# Altium schematic sheet TOPLEVEL.SchDoc
size A2; Organization: Altium Limited; Address1: L3, 12a Rodborough Rd; Address2: Frenchs Forest; Address3: NSW; Address4: Australia 2086
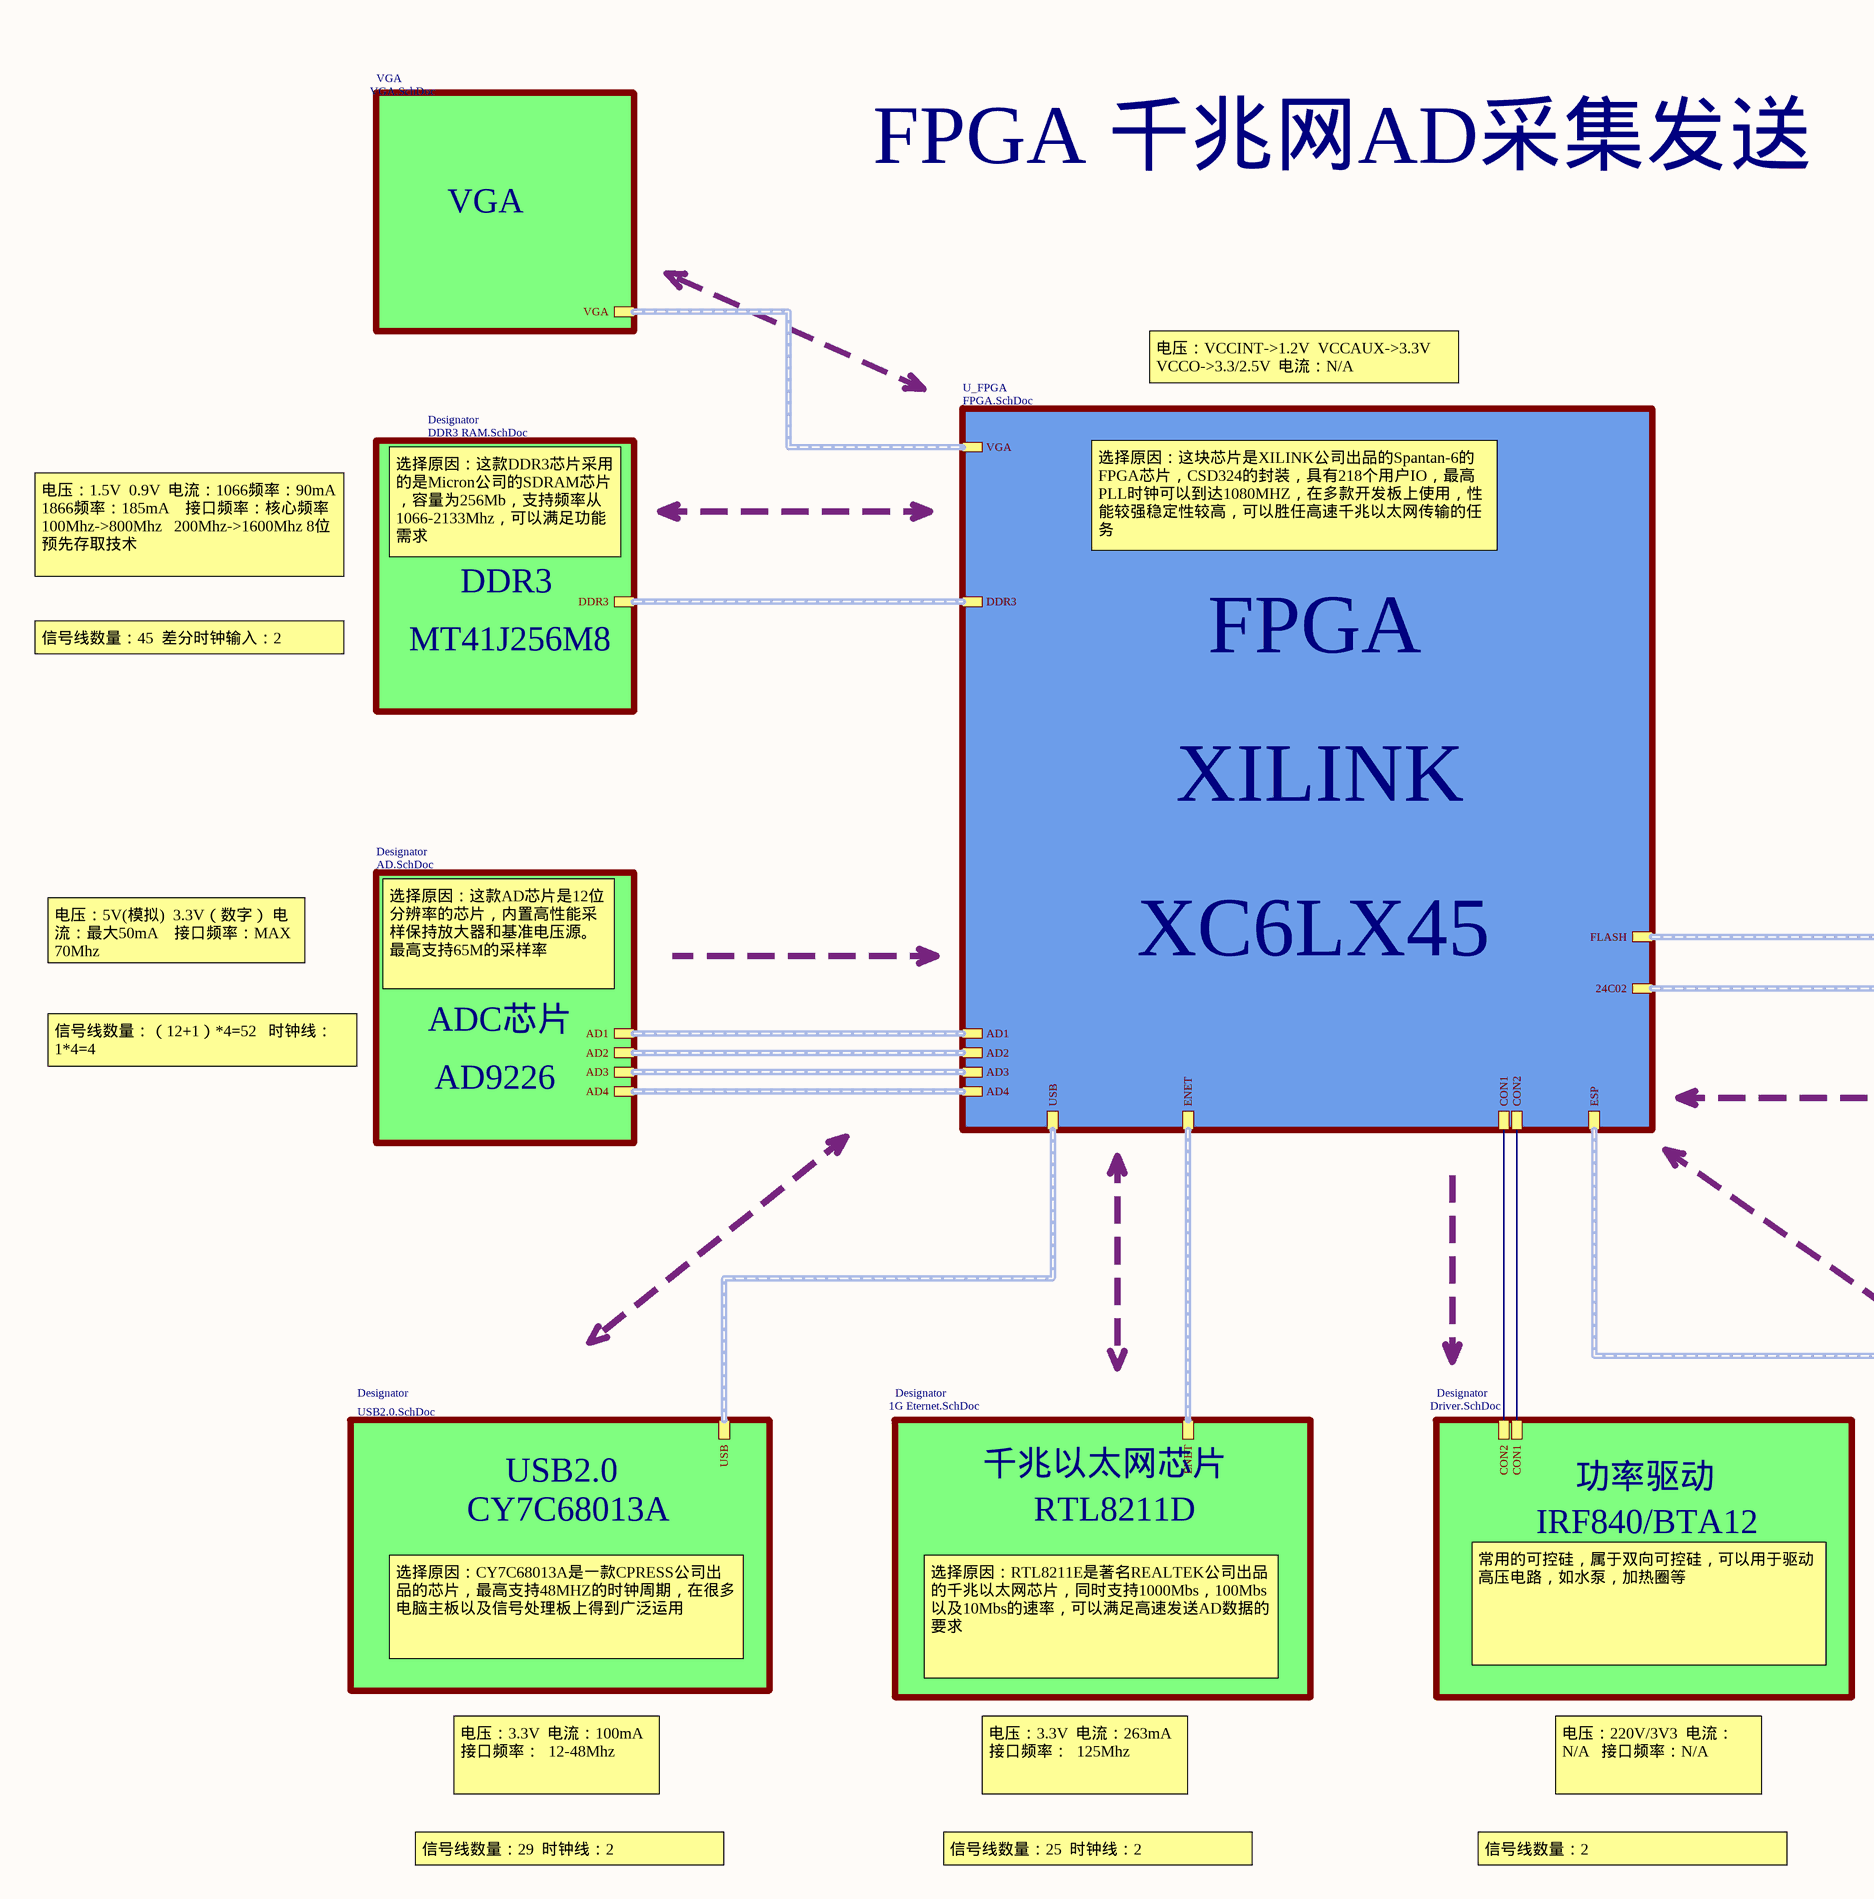
[diagram p0: TOPLEVEL.SchDoc, left]
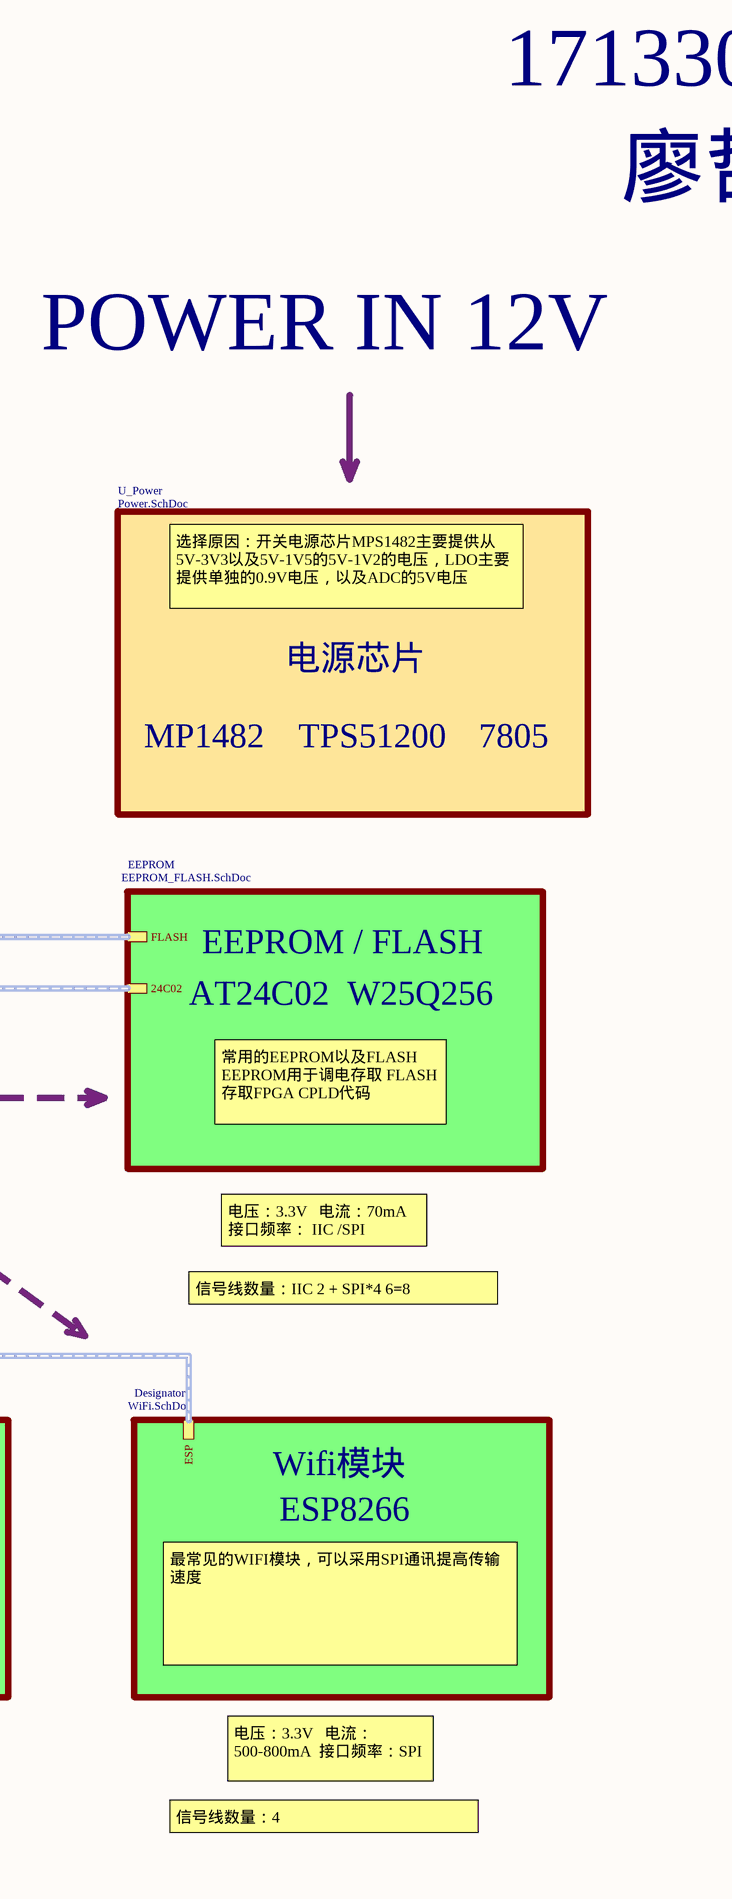
[diagram p1: TOPLEVEL.SchDoc, right]

## Sub-sheets
Designator = 1G Eternet.SchDoc: ENET (harness ENET)
Designator = USB2.0.SchDoc: USB (harness USB)
Designator = DDR3 RAM.SchDoc: DDR3 (harness DDR3)
Designator = AD.SchDoc: AD2 (harness AD2), AD1 (harness AD1), AD4 (harness AD4), AD3 (harness AD3)
Designator = Driver.SchDoc: CON2, CON1
Designator = WiFi.SchDoc: ESP (harness ESP)
EEPROM = EEPROM_FLASH.SchDoc: 24C02 (harness 24C02), FLASH (harness FLASH)
U_FPGA = FPGA.SchDoc: DDR3 (harness DDR3), USB (harness USB), CON1, CON2, AD3 (harness AD3), AD2 (harness AD2), AD4 (harness AD4), AD1 (harness AD1), ENET (harness ENET), ESP (harness ESP), 24C02 (harness 24C02), FLASH (harness FLASH), VGA (harness VGA)
U_Power = Power.SchDoc: no entries
VGA = VGA.SchDoc: VGA (harness VGA)

## Nets
(unnamed): sheet U_FPGA/CON1, sheet Designator/CON2
(unnamed): sheet U_FPGA/CON2, sheet Designator/CON1

## Buses and harness runs
harness sheet Designator/AD1 = sheet U_FPGA/AD1
harness sheet Designator/AD2 = sheet U_FPGA/AD2
harness sheet Designator/AD3 = sheet U_FPGA/AD3
harness sheet Designator/AD4 = sheet U_FPGA/AD4
harness sheet Designator/DDR3 = sheet U_FPGA/DDR3
harness sheet Designator/ENET = sheet U_FPGA/ENET
harness sheet Designator/ESP = sheet U_FPGA/ESP
harness sheet Designator/USB = sheet U_FPGA/USB
harness sheet EEPROM/24C02 = sheet U_FPGA/24C02
harness sheet EEPROM/FLASH = sheet U_FPGA/FLASH
harness sheet U_FPGA/VGA = sheet VGA/VGA

## Notes on the sheet
- 1713304422
- FPGA 千兆网AD采集发送
- VGA
- 廖哲霖
- 电压：VCCINT->1.2V  VCCAUX->3.3V VCCO->3.3/2.5V  电流：N/A
- POWER IN 12V
- 电压：1.5V  0.9V  电流：1066频率：90mA  1866频率：185mA    接口频率：核心频率100Mhz->800Mhz   200Mhz->1600Mhz 8位预先存取技术
- 选择原因：这款DDR3芯片采用的是Micron公司的SDRAM芯片，容量为256Mb，支持频率从1066-2133Mhz，可以满足功能需求
- 选择原因：这块芯片是XILINK公司出品的Spantan-6的FPGA芯片，CSD324的封装，具有218个用户IO，最高PLL时钟可以到达1080MHZ，在多款开发板上使用，性能较强稳定性较高，可以胜任高速千兆以太网传输的任务
- DDR3
- 选择原因：开关电源芯片MPS1482主要提供从5V-3V3以及5V-1V5的5V-1V2的电压，LDO主要提供单独的0.9V电压，以及ADC的5V电压
- 信号线数量：45  差分时钟输入：2
- MT41J256M8
- FPGA
- 电源芯片
- MP1482
- TPS51200
- 7805
- XILINK
- 电压：5V(模拟)  3.3V（数字） 电流：最大50mA    接口频率：MAX 70Mhz
- EEPROM / FLASH
- 选择原因：这款AD芯片是12位分辨率的芯片，内置高性能采样保持放大器和基准电压源。最高支持65M的采样率
- XC6LX45
- AT24C02  W25Q256
- 信号线数量：（12+1）*4=52   时钟线：1*4=4
- ADC芯片
- AD9226
- 常用的EEPROM以及FLASH EEPROM用于调电存取 FLASH存取FPGA CPLD代码
- 电压：3.3V   电流：70mA 接口频率： IIC /SPI
- 信号线数量：IIC 2 + SPI*4 6=8
- 千兆以太网芯片
- Wifi模块
- CY7C68013A
- USB2.0
- RTL8211D
- IRF840/BTA12
- 功率驱动
- ESP8266
- 选择原因：CY7C68013A是一款CPRESS公司出品的芯片，最高支持48MHZ的时钟周期，在很多电脑主板以及信号处理板上得到广泛运用
- 常用的可控硅，属于双向可控硅，可以用于驱动高压电路，如水泵，加热圈等
- 最常见的WIFI模块，可以采用SPI通讯提高传输速度
- 选择原因：RTL8211E是著名REALTEK公司出品的千兆以太网芯片，同时支持1000Mbs，100Mbs以及10Mbs的速率，可以满足高速发送AD数据的要求
- 电压：3.3V  电流：100mA  接口频率：  12-48Mhz
- 电压：3.3V  电流：263mA  接口频率：  125Mhz
- 电压：220V/3V3  电流：N/A   接口频率：N/A
- 电压：3.3V   电流：500-800mA  接口频率：SPI
- 信号线数量：29  时钟线：2
- 信号线数量：25  时钟线：2
- 信号线数量：2
- 信号线数量：4
- Title
- Size:
- Date:
- File:
- A2
- Number:
- Time:
- Revision:
- Sheet
- of